# EAGLE design LilyPad_Temperature_Sensor (EAGLE 7.2.0)
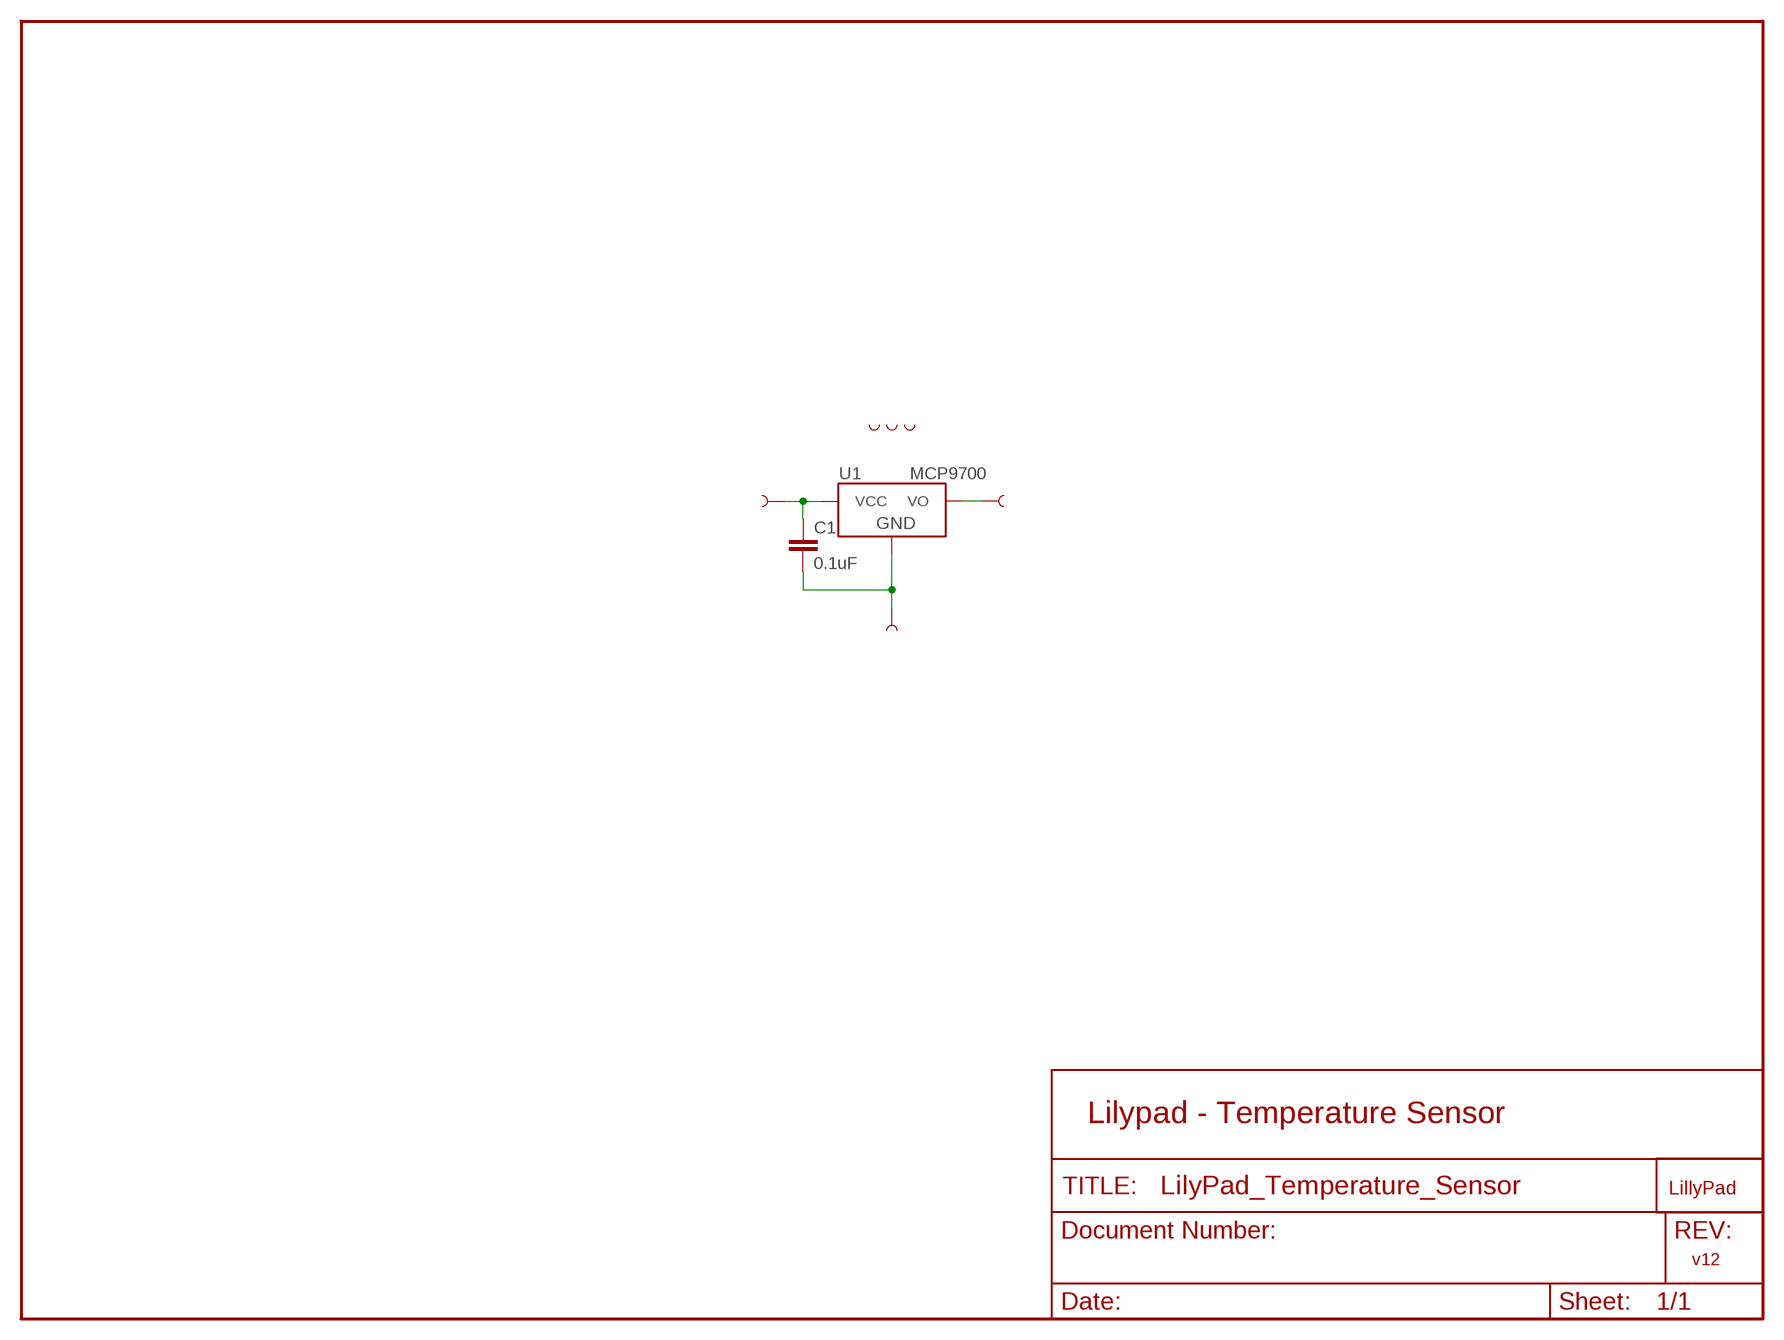
[diagram p0: schematic, sheet 1]

## Parts
C1  0.1uF  CAP0603-CAP  [0603-CAP]
TEMP1  SEWTAP-NOHOLE2  [PETAL-NOHOLE-2SIDE]
TEMP2  SEWTAP-NOHOLE2  [PETAL-NOHOLE-2SIDE]
TEMP3  SEWTAP-NOHOLE2  [PETAL-NOHOLE-2SIDE]
TEMP+  SEWTAP6  [PETAL-SMALL-2SIDE]
TEMP-  SEWTAP6  [PETAL-SMALL-2SIDE]
TEMPS  SEWTAP6  [PETAL-SMALL-2SIDE]
U1  MCP9700  MCP9700SMD  [SOT23-3]
U$2  LOGO-LPLP  [LOGO-LILYPAD]

## Nets
GND: C1.2 TEMP-.1 U1.3(GND)
VCC: C1.1 TEMP+.1 U1.1(VCC)
VO: TEMPS.1 U1.2(VO)

## Notes on the sheet
- Lilypad - Temperature Sensor
- v12

## Library data of the parts
C1 = SparkFun:CAP: Capacitor Standard 0603 ceramic capacitor, and 0.1" leaded capacitor.
TEMP1-TEMP3 = LilyPad-Wearables:SEWTAP-NOHOLE
TEMP+ TEMP- TEMPS = LilyPad-Wearables:SEWTAP
U1 = SparkFun:MCP9700
U$2 = LilyPad-Wearables:LOGO-LP

## Board
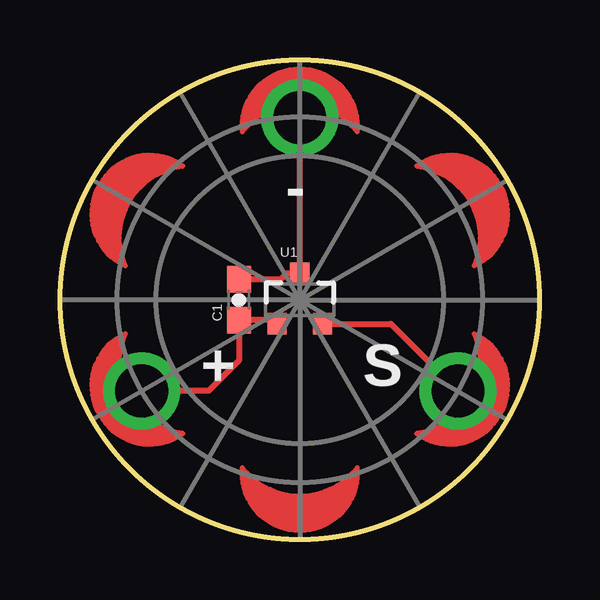
[diagram p1: board, top side]
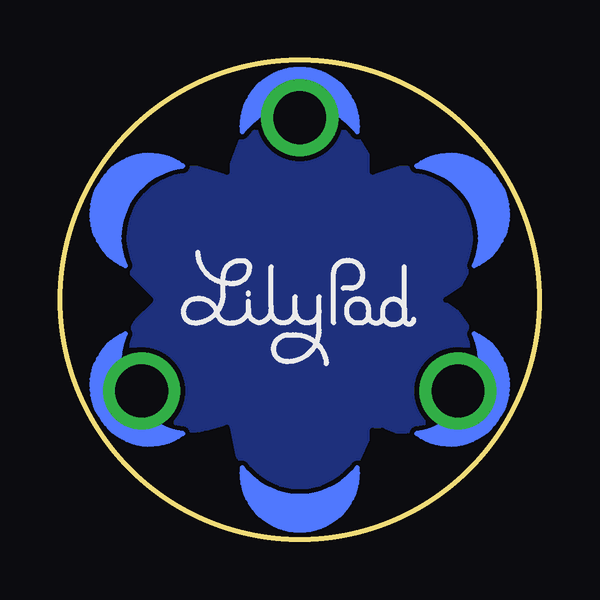
[diagram p2: board, bottom side, seen from below]

Size 20 x 20 mm. Coordinates in mm from the lower left corner, seen from the top.
Outline: circle at 10,10 radius 10
Copper layers (1*16): Top 0.035mm / dielectric 1.5mm / Bottom 0.035mm
Design rules "SparkFun": minimum track width 8mil, minimum drill 20mil, track to track 8mil, track to pad 8mil, pad to pad 8mil, via to via 8mil, smd to smd 8mil, copper to edge 8mil, drill to drill 8mil, minimum pad ring 12mil, minimum via ring 10mil, stop-mask expansion 4mil, vias tented up to drill 20mil, thermal gap 10mil
bKeepout: 6 lines
bRestrict: area 10,-1 to 21,10; area 10,10 to 21,21; area -1,10 to 10,21; area -1,-1 to 10,10

### Footprints (pad centres in the part's own frame; a part is rotated, then mirrored left to right if it is on the bottom)
0603-CAP = smd 1.1 x 1: 1 -0.85,0; 2 0.85,0
PETAL-SMALL-2SIDE = drill 2.2: 1 0,0
SOT23-3 = smd 0.8 x 0.9: 1 -0.95,-1; 2 0.95,-1; 3 0,1.1

### Placement (x,y rotation side)
C1  7.46,10 90 top
TEMP1  3.4,13.8 240 top
TEMP2  10,2.4 0 top
TEMP3  16.6,13.8 120 top
TEMP+  3.4,6.2 300 top
TEMP-  10,17.6 180 top
TEMPS  16.6,6.2 60 top
U1  10,10 0 top
U$2  10,10 0 bottom

### Tracks (layer width: path | path; a pad name or v marks a point on that pad's centre or on a via)
GND
  Top 0.254: TEMP-.1 U1.3 9.45,11.1 9.2,10.85 C1.2
N$1
  pour Bottom: -1,21 21,21 21,-1 -1,-1
VCC
  Top 0.254: TEMP+.1 6.2,6.2 7.46,7.46 C1.1 8.9,9.15 U1.1
  Top 0.406: U1.1 9,9
VO
  Top 0.254: 11,9 13.8,9 TEMPS.1
  Top 0.406: U1.2 11,9

### Text on the board
tPlace: - | + | S